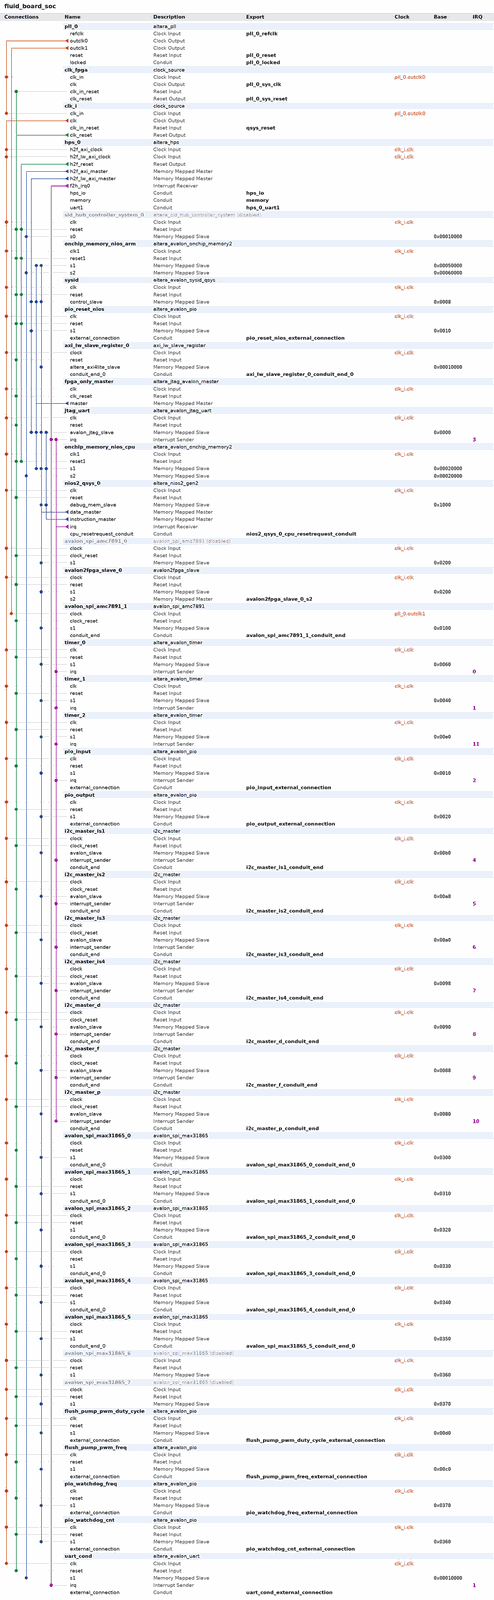
[diagram p0: system contents, whole]
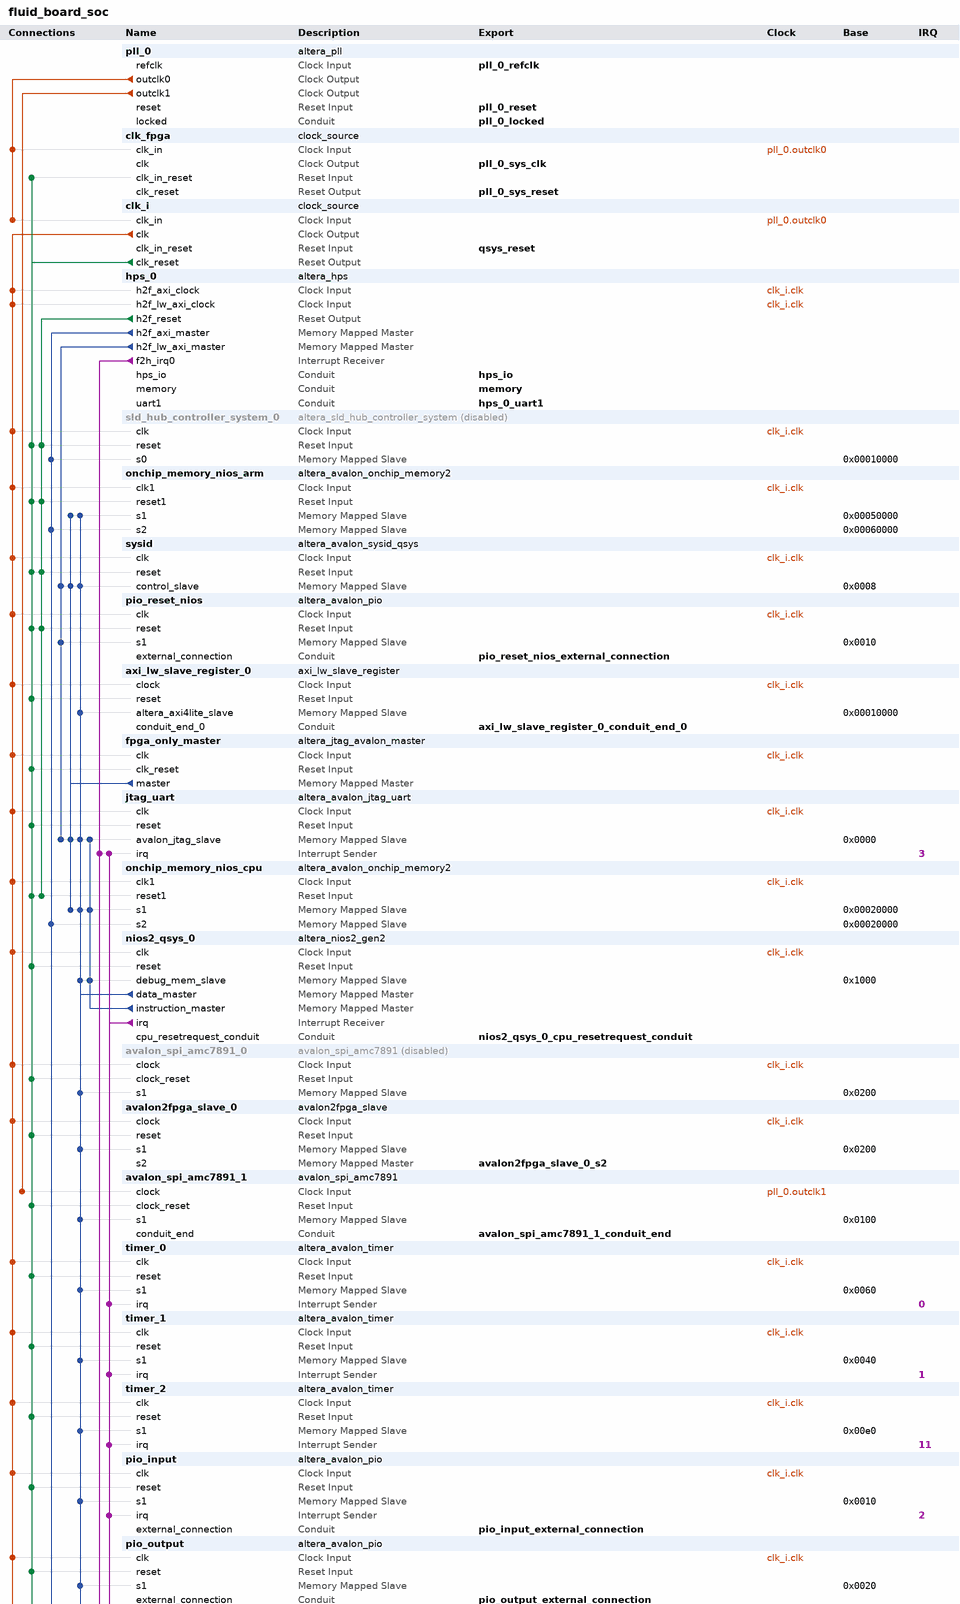
[diagram p1: system contents, upper part]
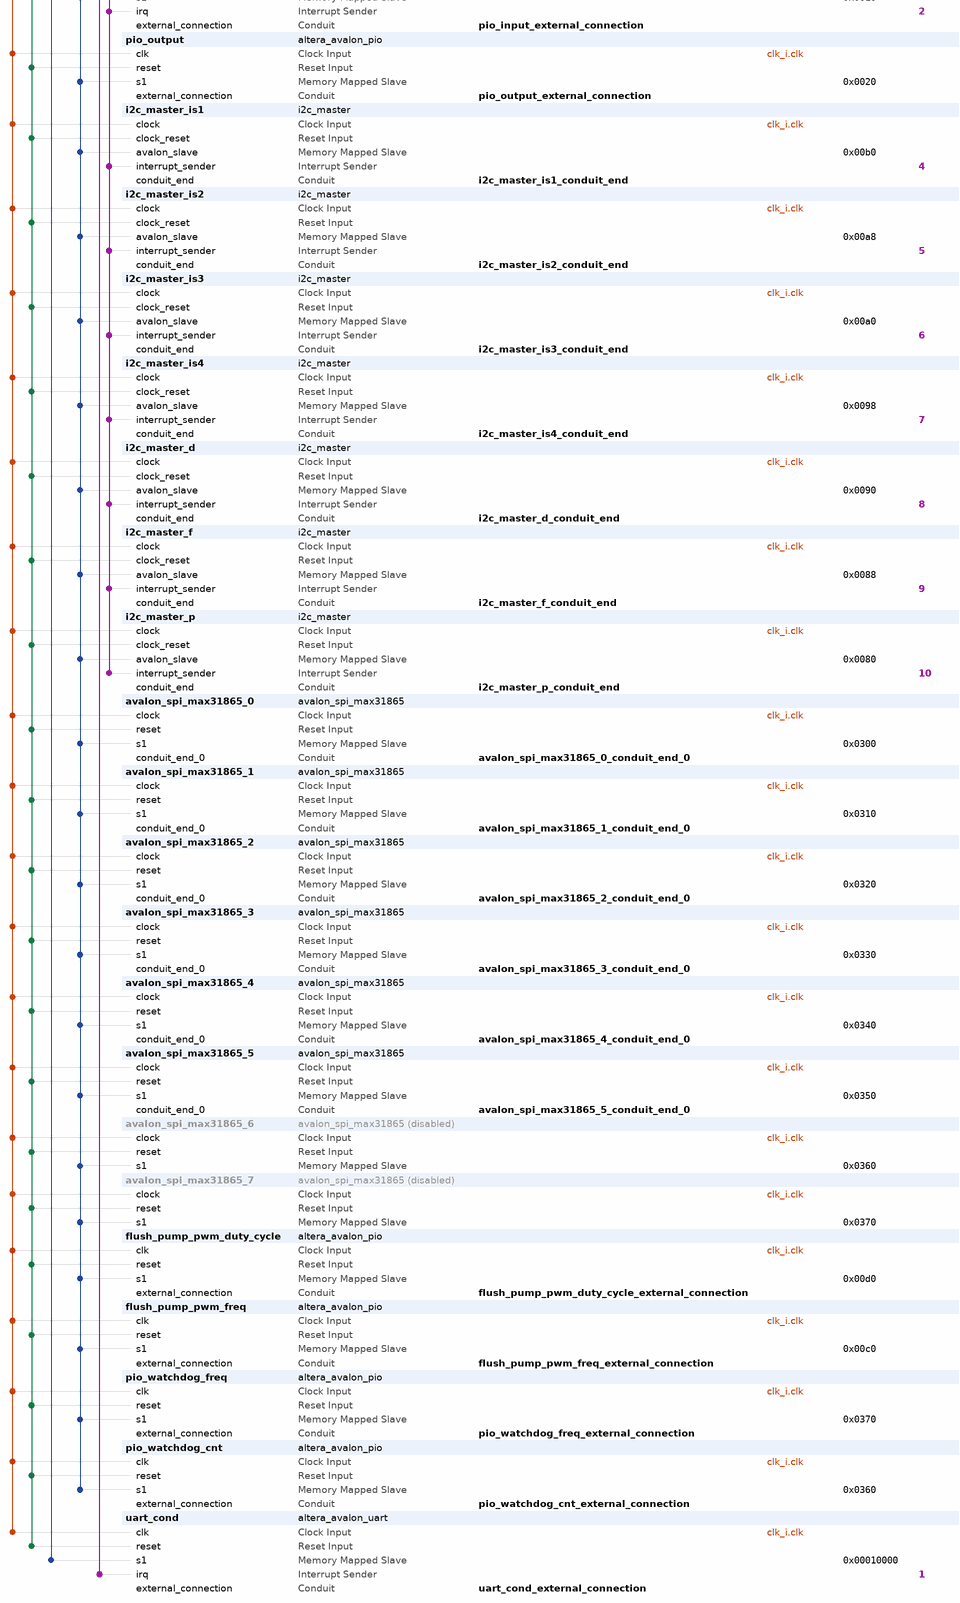
[diagram p2: system contents, lower part]
# Platform Designer (Qsys) system fluid_board_soc, Cyclone V 5CSEBA2U23C8
# Parameters at their usual value, and those the tool derives, are not listed.
package require -exact qsys 17.1
create_system fluid_board_soc
set_project_property DEVICE_FAMILY {Cyclone V}
set_project_property DEVICE 5CSEBA2U23C8

add_instance pll_0 altera_pll 17.1
set_instance_parameter_value pll_0 gui_device_speed_grade 2
set_instance_parameter_value pll_0 gui_number_of_clocks 2
set_instance_parameter_value pll_0 gui_operation_mode direct
set_instance_parameter_value pll_0 gui_output_clock_frequency0 50.0
set_instance_parameter_value pll_0 gui_output_clock_frequency1 12.5
set_instance_parameter_value pll_0 gui_pll_mode {Integer-N PLL}
set_instance_parameter_value pll_0 gui_reference_clock_frequency 50.0
set_instance_parameter_value pll_0 gui_use_locked true

add_instance clk_fpga clock_source 17.1
set_instance_parameter_value clk_fpga clockFrequency 50000000

add_instance clk_i clock_source 17.1
set_instance_parameter_value clk_i clockFrequency 50000000

add_instance hps_0 altera_hps 17.1
set_instance_parameter_value hps_0 EMAC0_Mode RGMII
set_instance_parameter_value hps_0 EMAC0_PinMuxing {HPS I/O Set 0}
set_instance_parameter_value hps_0 EMAC1_Mode N/A
set_instance_parameter_value hps_0 EMAC1_PinMuxing Unused
set_instance_parameter_value hps_0 F2SCLK_COLDRST_Enable false
set_instance_parameter_value hps_0 F2SCLK_DBGRST_Enable false
set_instance_parameter_value hps_0 F2SCLK_WARMRST_Enable false
set_instance_parameter_value hps_0 F2SINTERRUPT_Enable true
set_instance_parameter_value hps_0 F2S_Width 0
set_instance_parameter_value hps_0 FPGA_PERIPHERAL_OUTPUT_CLOCK_FREQ_EMAC0_GTX_CLK 100
set_instance_parameter_value hps_0 FPGA_PERIPHERAL_OUTPUT_CLOCK_FREQ_EMAC0_MD_CLK 100.0
set_instance_parameter_value hps_0 FPGA_PERIPHERAL_OUTPUT_CLOCK_FREQ_EMAC1_GTX_CLK 100
set_instance_parameter_value hps_0 FPGA_PERIPHERAL_OUTPUT_CLOCK_FREQ_EMAC1_MD_CLK 100.0
set_instance_parameter_value hps_0 HPS_PROTOCOL DDR3
set_instance_parameter_value hps_0 I2C0_Mode N/A
set_instance_parameter_value hps_0 I2C0_PinMuxing Unused
set_instance_parameter_value hps_0 I2C1_Mode N/A
set_instance_parameter_value hps_0 I2C1_PinMuxing Unused
set_instance_parameter_value hps_0 LWH2F_Enable true
set_instance_parameter_value hps_0 MEM_BANKADDR_WIDTH 3
set_instance_parameter_value hps_0 MEM_CLK_FREQ 333.3
set_instance_parameter_value hps_0 MEM_COL_ADDR_WIDTH 10
set_instance_parameter_value hps_0 MEM_DQ_WIDTH 32
set_instance_parameter_value hps_0 MEM_DRV_STR RZQ/6
set_instance_parameter_value hps_0 MEM_ROW_ADDR_WIDTH 15
set_instance_parameter_value hps_0 MEM_RTT_NOM RZQ/6
set_instance_parameter_value hps_0 MEM_RTT_WR {Dynamic ODT off}
set_instance_parameter_value hps_0 MEM_TCL 6
set_instance_parameter_value hps_0 MEM_TFAW_NS 40.0
set_instance_parameter_value hps_0 MEM_TINIT_US 512
set_instance_parameter_value hps_0 MEM_TRAS_NS 35.0
set_instance_parameter_value hps_0 MEM_TRCD_NS 13.75
set_instance_parameter_value hps_0 MEM_TREFI_US 3.9
set_instance_parameter_value hps_0 MEM_TRFC_NS 350.0
set_instance_parameter_value hps_0 MEM_TRP_NS 13.75
set_instance_parameter_value hps_0 MEM_TRRD_NS 12.0
set_instance_parameter_value hps_0 MEM_TRTP_NS 12.0
set_instance_parameter_value hps_0 MEM_VENDOR JEDEC
set_instance_parameter_value hps_0 MEM_VOLTAGE {1.35V DDR3L}
set_instance_parameter_value hps_0 MEM_WTCL 6
set_instance_parameter_value hps_0 QSPI_Mode N/A
set_instance_parameter_value hps_0 QSPI_PinMuxing Unused
set_instance_parameter_value hps_0 REF_CLK_FREQ 25.0
set_instance_parameter_value hps_0 S2FCLK_USER2CLK 4
set_instance_parameter_value hps_0 S2F_Width 2
set_instance_parameter_value hps_0 SDIO_Mode {8-bit Data}
set_instance_parameter_value hps_0 SDIO_PinMuxing {HPS I/O Set 0}
set_instance_parameter_value hps_0 SPIM1_Mode N/A
set_instance_parameter_value hps_0 SPIM1_PinMuxing Unused
set_instance_parameter_value hps_0 STM_Enable false
set_instance_parameter_value hps_0 TIMING_BOARD_AC_SKEW 0.02
set_instance_parameter_value hps_0 TIMING_BOARD_AC_TO_CK_SKEW 0.0
set_instance_parameter_value hps_0 TIMING_BOARD_DQ_TO_DQS_SKEW 0.0
set_instance_parameter_value hps_0 TIMING_BOARD_MAX_CK_DELAY 0.6
set_instance_parameter_value hps_0 TIMING_BOARD_MAX_DQS_DELAY 0.6
set_instance_parameter_value hps_0 TIMING_BOARD_SKEW_BETWEEN_DQS 0.02
set_instance_parameter_value hps_0 TIMING_BOARD_SKEW_CKDQS_DIMM_MAX 0.01
set_instance_parameter_value hps_0 TIMING_BOARD_SKEW_CKDQS_DIMM_MIN -0.01
set_instance_parameter_value hps_0 TIMING_BOARD_SKEW_WITHIN_DQS 0.02
set_instance_parameter_value hps_0 TIMING_TDH 45
set_instance_parameter_value hps_0 TIMING_TDQSCK 225
set_instance_parameter_value hps_0 TIMING_TDQSQ 100
set_instance_parameter_value hps_0 TIMING_TDQSS 0.27
set_instance_parameter_value hps_0 TIMING_TDS 10
set_instance_parameter_value hps_0 TIMING_TDSH 0.18
set_instance_parameter_value hps_0 TIMING_TDSS 0.18
set_instance_parameter_value hps_0 TIMING_TIH 120
set_instance_parameter_value hps_0 TIMING_TIS 45
set_instance_parameter_value hps_0 TIMING_TQSH 0.4
set_instance_parameter_value hps_0 UART0_Mode {No Flow Control}
set_instance_parameter_value hps_0 UART0_PinMuxing {HPS I/O Set 0}
set_instance_parameter_value hps_0 UART1_Mode Full
set_instance_parameter_value hps_0 UART1_PinMuxing FPGA
set_instance_parameter_value hps_0 USB1_Mode SDR
set_instance_parameter_value hps_0 USB1_PinMuxing {HPS I/O Set 1}
set_instance_parameter_value hps_0 desired_cfg_clk_mhz 100.0
set_instance_parameter_value hps_0 desired_qspi_clk_mhz 400.0

add_instance sld_hub_controller_system_0 altera_sld_hub_controller_system 17.1
set_instance_property sld_hub_controller_system_0 ENABLED false
set_instance_parameter_value sld_hub_controller_system_0 ENABLE_JTAG_IO_SELECTION 0

add_instance onchip_memory_nios_arm altera_avalon_onchip_memory2 17.1
set_instance_parameter_value onchip_memory_nios_arm dataWidth 16
set_instance_parameter_value onchip_memory_nios_arm dualPort true
set_instance_parameter_value onchip_memory_nios_arm initMemContent true
set_instance_parameter_value onchip_memory_nios_arm initializationFileName onchip_mem.hex
set_instance_parameter_value onchip_memory_nios_arm memorySize 32768
set_instance_parameter_value onchip_memory_nios_arm singleClockOperation true

add_instance sysid altera_avalon_sysid_qsys 17.1
set_instance_parameter_value sysid id 7

add_instance pio_reset_nios altera_avalon_pio 17.1
set_instance_parameter_value pio_reset_nios direction Output
set_instance_parameter_value pio_reset_nios width 1

add_instance axi_lw_slave_register_0 axi_lw_slave_register 15.1
set_instance_parameter_value axi_lw_slave_register_0 g_master_addr_width 16
set_instance_parameter_value axi_lw_slave_register_0 g_master_data_width 32
set_instance_parameter_value axi_lw_slave_register_0 g_master_id_width 12

add_instance fpga_only_master altera_jtag_avalon_master 17.1

add_instance jtag_uart altera_avalon_jtag_uart 17.1
set_instance_parameter_value jtag_uart allowMultipleConnections true
set_instance_parameter_value jtag_uart simInteractiveOptions NO_INTERACTIVE_WINDOWS

add_instance onchip_memory_nios_cpu altera_avalon_onchip_memory2 17.1
set_instance_parameter_value onchip_memory_nios_cpu dataWidth 32
set_instance_parameter_value onchip_memory_nios_cpu dualPort true
set_instance_parameter_value onchip_memory_nios_cpu initMemContent true
set_instance_parameter_value onchip_memory_nios_cpu initializationFileName onchip_mem.hex
set_instance_parameter_value onchip_memory_nios_cpu memorySize 98304
set_instance_parameter_value onchip_memory_nios_cpu singleClockOperation true

add_instance nios2_qsys_0 altera_nios2_gen2 17.1
set_instance_parameter_value nios2_qsys_0 cpuReset true
set_instance_parameter_value nios2_qsys_0 dcache_size 0
set_instance_parameter_value nios2_qsys_0 exceptionSlave onchip_memory_nios_cpu.s1
set_instance_parameter_value nios2_qsys_0 icache_size 512
set_instance_parameter_value nios2_qsys_0 impl Fast
set_instance_parameter_value nios2_qsys_0 resetSlave onchip_memory_nios_cpu.s1
set_instance_parameter_value nios2_qsys_0 setting_activateTrace true

add_instance avalon_spi_amc7891_0 avalon_spi_amc7891 14.0
set_instance_property avalon_spi_amc7891_0 ENABLED false

add_instance avalon2fpga_slave_0 avalon2fpga_slave 5.1
set_instance_parameter_value avalon2fpga_slave_0 g_address_width 7
set_instance_parameter_value avalon2fpga_slave_0 g_data_width 16

add_instance avalon_spi_amc7891_1 avalon_spi_amc7891 14.0

add_instance timer_0 altera_avalon_timer 17.1
set_instance_parameter_value timer_0 period 1
set_instance_parameter_value timer_0 periodUnits MSEC

add_instance timer_1 altera_avalon_timer 17.1
set_instance_parameter_value timer_1 period 1
set_instance_parameter_value timer_1 periodUnits MSEC

add_instance timer_2 altera_avalon_timer 17.1
set_instance_parameter_value timer_2 period 1
set_instance_parameter_value timer_2 periodUnits MSEC

add_instance pio_input altera_avalon_pio 17.1
set_instance_parameter_value pio_input direction Input
set_instance_parameter_value pio_input generateIRQ true
set_instance_parameter_value pio_input width 15

add_instance pio_output altera_avalon_pio 17.1
set_instance_parameter_value pio_output bitModifyingOutReg true
set_instance_parameter_value pio_output direction Output
set_instance_parameter_value pio_output width 16

add_instance i2c_master_is1 i2c_master 14.1

add_instance i2c_master_is2 i2c_master 14.1

add_instance i2c_master_is3 i2c_master 14.1

add_instance i2c_master_is4 i2c_master 14.1

add_instance i2c_master_d i2c_master 14.1

add_instance i2c_master_f i2c_master 14.1

add_instance i2c_master_p i2c_master 14.1

add_instance avalon_spi_max31865_0 avalon_spi_max31865 1.0
set_instance_parameter_value avalon_spi_max31865_0 g_cpol {'0'}

add_instance avalon_spi_max31865_1 avalon_spi_max31865 1.0
set_instance_parameter_value avalon_spi_max31865_1 g_cpol {'0'}

add_instance avalon_spi_max31865_2 avalon_spi_max31865 1.0
set_instance_parameter_value avalon_spi_max31865_2 g_cpol {'0'}

add_instance avalon_spi_max31865_3 avalon_spi_max31865 1.0
set_instance_parameter_value avalon_spi_max31865_3 g_cpol {'0'}

add_instance avalon_spi_max31865_4 avalon_spi_max31865 1.0
set_instance_parameter_value avalon_spi_max31865_4 g_cpol {'0'}

add_instance avalon_spi_max31865_5 avalon_spi_max31865 1.0
set_instance_parameter_value avalon_spi_max31865_5 g_cpol {'0'}

add_instance avalon_spi_max31865_6 avalon_spi_max31865 1.0
set_instance_property avalon_spi_max31865_6 ENABLED false
set_instance_parameter_value avalon_spi_max31865_6 g_cpol {'0'}

add_instance avalon_spi_max31865_7 avalon_spi_max31865 1.0
set_instance_property avalon_spi_max31865_7 ENABLED false
set_instance_parameter_value avalon_spi_max31865_7 g_cpol {'0'}

add_instance flush_pump_pwm_duty_cycle altera_avalon_pio 17.1
set_instance_parameter_value flush_pump_pwm_duty_cycle direction Output
set_instance_parameter_value flush_pump_pwm_duty_cycle width 32

add_instance flush_pump_pwm_freq altera_avalon_pio 17.1
set_instance_parameter_value flush_pump_pwm_freq direction Output
set_instance_parameter_value flush_pump_pwm_freq width 32

add_instance pio_watchdog_freq altera_avalon_pio 17.1
set_instance_parameter_value pio_watchdog_freq direction Output
set_instance_parameter_value pio_watchdog_freq width 32

add_instance pio_watchdog_cnt altera_avalon_pio 17.1
set_instance_parameter_value pio_watchdog_cnt direction Output
set_instance_parameter_value pio_watchdog_cnt width 32

add_instance uart_cond altera_avalon_uart 17.1
set_instance_parameter_value uart_cond baud 115200
set_instance_parameter_value uart_cond dataBits 8
set_instance_parameter_value uart_cond fixedBaud false
set_instance_parameter_value uart_cond parity NONE
set_instance_parameter_value uart_cond stopBits 1

# connections
add_connection clk_i.clk avalon2fpga_slave_0.clock clock
add_connection clk_i.clk avalon_spi_amc7891_0.clock clock
add_connection clk_i.clk avalon_spi_max31865_0.clock clock
add_connection clk_i.clk avalon_spi_max31865_1.clock clock
add_connection clk_i.clk avalon_spi_max31865_2.clock clock
add_connection clk_i.clk avalon_spi_max31865_3.clock clock
add_connection clk_i.clk avalon_spi_max31865_4.clock clock
add_connection clk_i.clk avalon_spi_max31865_5.clock clock
add_connection clk_i.clk avalon_spi_max31865_6.clock clock
add_connection clk_i.clk avalon_spi_max31865_7.clock clock
add_connection clk_i.clk axi_lw_slave_register_0.clock clock
add_connection clk_i.clk flush_pump_pwm_duty_cycle.clk clock
add_connection clk_i.clk flush_pump_pwm_freq.clk clock
add_connection clk_i.clk fpga_only_master.clk clock
add_connection clk_i.clk hps_0.h2f_axi_clock clock
add_connection clk_i.clk hps_0.h2f_lw_axi_clock clock
add_connection clk_i.clk i2c_master_d.clock clock
add_connection clk_i.clk i2c_master_f.clock clock
add_connection clk_i.clk i2c_master_is1.clock clock
add_connection clk_i.clk i2c_master_is2.clock clock
add_connection clk_i.clk i2c_master_is3.clock clock
add_connection clk_i.clk i2c_master_is4.clock clock
add_connection clk_i.clk i2c_master_p.clock clock
add_connection clk_i.clk jtag_uart.clk clock
add_connection clk_i.clk nios2_qsys_0.clk clock
add_connection clk_i.clk onchip_memory_nios_arm.clk1 clock
add_connection clk_i.clk onchip_memory_nios_cpu.clk1 clock
add_connection clk_i.clk pio_input.clk clock
add_connection clk_i.clk pio_output.clk clock
add_connection clk_i.clk pio_reset_nios.clk clock
add_connection clk_i.clk pio_watchdog_cnt.clk clock
add_connection clk_i.clk pio_watchdog_freq.clk clock
add_connection clk_i.clk sld_hub_controller_system_0.clk clock
add_connection clk_i.clk sysid.clk clock
add_connection clk_i.clk timer_0.clk clock
add_connection clk_i.clk timer_1.clk clock
add_connection clk_i.clk timer_2.clk clock
add_connection clk_i.clk uart_cond.clk clock
add_connection pll_0.outclk0 clk_fpga.clk_in clock
add_connection pll_0.outclk0 clk_i.clk_in clock
add_connection pll_0.outclk1 avalon_spi_amc7891_1.clock clock
add_connection clk_i.clk_reset avalon2fpga_slave_0.reset reset
add_connection clk_i.clk_reset avalon_spi_amc7891_0.clock_reset reset
add_connection clk_i.clk_reset avalon_spi_amc7891_1.clock_reset reset
add_connection clk_i.clk_reset avalon_spi_max31865_0.reset reset
add_connection clk_i.clk_reset avalon_spi_max31865_1.reset reset
add_connection clk_i.clk_reset avalon_spi_max31865_2.reset reset
add_connection clk_i.clk_reset avalon_spi_max31865_3.reset reset
add_connection clk_i.clk_reset avalon_spi_max31865_4.reset reset
add_connection clk_i.clk_reset avalon_spi_max31865_5.reset reset
add_connection clk_i.clk_reset avalon_spi_max31865_6.reset reset
add_connection clk_i.clk_reset avalon_spi_max31865_7.reset reset
add_connection clk_i.clk_reset axi_lw_slave_register_0.reset reset
add_connection clk_i.clk_reset clk_fpga.clk_in_reset reset
add_connection clk_i.clk_reset flush_pump_pwm_duty_cycle.reset reset
add_connection clk_i.clk_reset flush_pump_pwm_freq.reset reset
add_connection clk_i.clk_reset fpga_only_master.clk_reset reset
add_connection clk_i.clk_reset i2c_master_d.clock_reset reset
add_connection clk_i.clk_reset i2c_master_f.clock_reset reset
add_connection clk_i.clk_reset i2c_master_is1.clock_reset reset
add_connection clk_i.clk_reset i2c_master_is2.clock_reset reset
add_connection clk_i.clk_reset i2c_master_is3.clock_reset reset
add_connection clk_i.clk_reset i2c_master_is4.clock_reset reset
add_connection clk_i.clk_reset i2c_master_p.clock_reset reset
add_connection clk_i.clk_reset jtag_uart.reset reset
add_connection clk_i.clk_reset nios2_qsys_0.reset reset
add_connection clk_i.clk_reset onchip_memory_nios_arm.reset1 reset
add_connection clk_i.clk_reset onchip_memory_nios_cpu.reset1 reset
add_connection clk_i.clk_reset pio_input.reset reset
add_connection clk_i.clk_reset pio_output.reset reset
add_connection clk_i.clk_reset pio_reset_nios.reset reset
add_connection clk_i.clk_reset pio_watchdog_cnt.reset reset
add_connection clk_i.clk_reset pio_watchdog_freq.reset reset
add_connection clk_i.clk_reset sld_hub_controller_system_0.reset reset
add_connection clk_i.clk_reset sysid.reset reset
add_connection clk_i.clk_reset timer_0.reset reset
add_connection clk_i.clk_reset timer_1.reset reset
add_connection clk_i.clk_reset timer_2.reset reset
add_connection clk_i.clk_reset uart_cond.reset reset
add_connection hps_0.h2f_reset onchip_memory_nios_arm.reset1 reset
add_connection hps_0.h2f_reset onchip_memory_nios_cpu.reset1 reset
add_connection hps_0.h2f_reset pio_reset_nios.reset reset
add_connection hps_0.h2f_reset sld_hub_controller_system_0.reset reset
add_connection hps_0.h2f_reset sysid.reset reset
add_connection fpga_only_master.master jtag_uart.avalon_jtag_slave avalon
set_connection_parameter_value fpga_only_master.master/jtag_uart.avalon_jtag_slave baseAddress 0x0000
add_connection fpga_only_master.master onchip_memory_nios_arm.s1 avalon
set_connection_parameter_value fpga_only_master.master/onchip_memory_nios_arm.s1 baseAddress 0x00050000
add_connection fpga_only_master.master onchip_memory_nios_cpu.s1 avalon
set_connection_parameter_value fpga_only_master.master/onchip_memory_nios_cpu.s1 baseAddress 0x00020000
add_connection fpga_only_master.master sysid.control_slave avalon
set_connection_parameter_value fpga_only_master.master/sysid.control_slave baseAddress 0x0008
add_connection hps_0.h2f_axi_master onchip_memory_nios_arm.s2 avalon
set_connection_parameter_value hps_0.h2f_axi_master/onchip_memory_nios_arm.s2 baseAddress 0x00060000
add_connection hps_0.h2f_axi_master onchip_memory_nios_cpu.s2 avalon
set_connection_parameter_value hps_0.h2f_axi_master/onchip_memory_nios_cpu.s2 baseAddress 0x00020000
add_connection hps_0.h2f_axi_master sld_hub_controller_system_0.s0 avalon
set_connection_parameter_value hps_0.h2f_axi_master/sld_hub_controller_system_0.s0 baseAddress 0x00010000
add_connection hps_0.h2f_axi_master uart_cond.s1 avalon
set_connection_parameter_value hps_0.h2f_axi_master/uart_cond.s1 baseAddress 0x00010000
add_connection hps_0.h2f_lw_axi_master jtag_uart.avalon_jtag_slave avalon
set_connection_parameter_value hps_0.h2f_lw_axi_master/jtag_uart.avalon_jtag_slave baseAddress 0x0000
add_connection hps_0.h2f_lw_axi_master pio_reset_nios.s1 avalon
set_connection_parameter_value hps_0.h2f_lw_axi_master/pio_reset_nios.s1 baseAddress 0x0010
add_connection hps_0.h2f_lw_axi_master sysid.control_slave avalon
set_connection_parameter_value hps_0.h2f_lw_axi_master/sysid.control_slave baseAddress 0x0008
add_connection nios2_qsys_0.data_master avalon2fpga_slave_0.s1 avalon
set_connection_parameter_value nios2_qsys_0.data_master/avalon2fpga_slave_0.s1 baseAddress 0x0200
add_connection nios2_qsys_0.data_master avalon_spi_amc7891_0.s1 avalon
set_connection_parameter_value nios2_qsys_0.data_master/avalon_spi_amc7891_0.s1 baseAddress 0x0200
add_connection nios2_qsys_0.data_master avalon_spi_amc7891_1.s1 avalon
set_connection_parameter_value nios2_qsys_0.data_master/avalon_spi_amc7891_1.s1 baseAddress 0x0100
add_connection nios2_qsys_0.data_master avalon_spi_max31865_0.s1 avalon
set_connection_parameter_value nios2_qsys_0.data_master/avalon_spi_max31865_0.s1 baseAddress 0x0300
add_connection nios2_qsys_0.data_master avalon_spi_max31865_1.s1 avalon
set_connection_parameter_value nios2_qsys_0.data_master/avalon_spi_max31865_1.s1 baseAddress 0x0310
add_connection nios2_qsys_0.data_master avalon_spi_max31865_2.s1 avalon
set_connection_parameter_value nios2_qsys_0.data_master/avalon_spi_max31865_2.s1 baseAddress 0x0320
add_connection nios2_qsys_0.data_master avalon_spi_max31865_3.s1 avalon
set_connection_parameter_value nios2_qsys_0.data_master/avalon_spi_max31865_3.s1 baseAddress 0x0330
add_connection nios2_qsys_0.data_master avalon_spi_max31865_4.s1 avalon
set_connection_parameter_value nios2_qsys_0.data_master/avalon_spi_max31865_4.s1 baseAddress 0x0340
add_connection nios2_qsys_0.data_master avalon_spi_max31865_5.s1 avalon
set_connection_parameter_value nios2_qsys_0.data_master/avalon_spi_max31865_5.s1 baseAddress 0x0350
add_connection nios2_qsys_0.data_master avalon_spi_max31865_6.s1 avalon
set_connection_parameter_value nios2_qsys_0.data_master/avalon_spi_max31865_6.s1 baseAddress 0x0360
add_connection nios2_qsys_0.data_master avalon_spi_max31865_7.s1 avalon
set_connection_parameter_value nios2_qsys_0.data_master/avalon_spi_max31865_7.s1 baseAddress 0x0370
add_connection nios2_qsys_0.data_master axi_lw_slave_register_0.altera_axi4lite_slave avalon
set_connection_parameter_value nios2_qsys_0.data_master/axi_lw_slave_register_0.altera_axi4lite_slave baseAddress 0x00010000
add_connection nios2_qsys_0.data_master flush_pump_pwm_duty_cycle.s1 avalon
set_connection_parameter_value nios2_qsys_0.data_master/flush_pump_pwm_duty_cycle.s1 baseAddress 0x00d0
add_connection nios2_qsys_0.data_master flush_pump_pwm_freq.s1 avalon
set_connection_parameter_value nios2_qsys_0.data_master/flush_pump_pwm_freq.s1 baseAddress 0x00c0
add_connection nios2_qsys_0.data_master i2c_master_d.avalon_slave avalon
set_connection_parameter_value nios2_qsys_0.data_master/i2c_master_d.avalon_slave baseAddress 0x0090
add_connection nios2_qsys_0.data_master i2c_master_f.avalon_slave avalon
set_connection_parameter_value nios2_qsys_0.data_master/i2c_master_f.avalon_slave baseAddress 0x0088
add_connection nios2_qsys_0.data_master i2c_master_is1.avalon_slave avalon
set_connection_parameter_value nios2_qsys_0.data_master/i2c_master_is1.avalon_slave baseAddress 0x00b0
add_connection nios2_qsys_0.data_master i2c_master_is2.avalon_slave avalon
set_connection_parameter_value nios2_qsys_0.data_master/i2c_master_is2.avalon_slave baseAddress 0x00a8
add_connection nios2_qsys_0.data_master i2c_master_is3.avalon_slave avalon
set_connection_parameter_value nios2_qsys_0.data_master/i2c_master_is3.avalon_slave baseAddress 0x00a0
add_connection nios2_qsys_0.data_master i2c_master_is4.avalon_slave avalon
set_connection_parameter_value nios2_qsys_0.data_master/i2c_master_is4.avalon_slave baseAddress 0x0098
add_connection nios2_qsys_0.data_master i2c_master_p.avalon_slave avalon
set_connection_parameter_value nios2_qsys_0.data_master/i2c_master_p.avalon_slave baseAddress 0x0080
add_connection nios2_qsys_0.data_master jtag_uart.avalon_jtag_slave avalon
set_connection_parameter_value nios2_qsys_0.data_master/jtag_uart.avalon_jtag_slave baseAddress 0x0000
add_connection nios2_qsys_0.data_master nios2_qsys_0.debug_mem_slave avalon
set_connection_parameter_value nios2_qsys_0.data_master/nios2_qsys_0.debug_mem_slave baseAddress 0x1000
add_connection nios2_qsys_0.data_master onchip_memory_nios_arm.s1 avalon
set_connection_parameter_value nios2_qsys_0.data_master/onchip_memory_nios_arm.s1 baseAddress 0x00050000
add_connection nios2_qsys_0.data_master onchip_memory_nios_cpu.s1 avalon
set_connection_parameter_value nios2_qsys_0.data_master/onchip_memory_nios_cpu.s1 baseAddress 0x00020000
add_connection nios2_qsys_0.data_master pio_input.s1 avalon
set_connection_parameter_value nios2_qsys_0.data_master/pio_input.s1 baseAddress 0x0010
add_connection nios2_qsys_0.data_master pio_output.s1 avalon
set_connection_parameter_value nios2_qsys_0.data_master/pio_output.s1 baseAddress 0x0020
add_connection nios2_qsys_0.data_master pio_watchdog_cnt.s1 avalon
set_connection_parameter_value nios2_qsys_0.data_master/pio_watchdog_cnt.s1 baseAddress 0x0360
add_connection nios2_qsys_0.data_master pio_watchdog_freq.s1 avalon
set_connection_parameter_value nios2_qsys_0.data_master/pio_watchdog_freq.s1 baseAddress 0x0370
add_connection nios2_qsys_0.data_master sysid.control_slave avalon
set_connection_parameter_value nios2_qsys_0.data_master/sysid.control_slave baseAddress 0x0008
add_connection nios2_qsys_0.data_master timer_0.s1 avalon
set_connection_parameter_value nios2_qsys_0.data_master/timer_0.s1 baseAddress 0x0060
add_connection nios2_qsys_0.data_master timer_1.s1 avalon
set_connection_parameter_value nios2_qsys_0.data_master/timer_1.s1 baseAddress 0x0040
add_connection nios2_qsys_0.data_master timer_2.s1 avalon
set_connection_parameter_value nios2_qsys_0.data_master/timer_2.s1 baseAddress 0x00e0
add_connection nios2_qsys_0.instruction_master jtag_uart.avalon_jtag_slave avalon
set_connection_parameter_value nios2_qsys_0.instruction_master/jtag_uart.avalon_jtag_slave baseAddress 0x0000
add_connection nios2_qsys_0.instruction_master nios2_qsys_0.debug_mem_slave avalon
set_connection_parameter_value nios2_qsys_0.instruction_master/nios2_qsys_0.debug_mem_slave baseAddress 0x1000
add_connection nios2_qsys_0.instruction_master onchip_memory_nios_cpu.s1 avalon
set_connection_parameter_value nios2_qsys_0.instruction_master/onchip_memory_nios_cpu.s1 baseAddress 0x00020000
add_connection hps_0.f2h_irq0 jtag_uart.irq interrupt
set_connection_parameter_value hps_0.f2h_irq0/jtag_uart.irq irqNumber 0
add_connection hps_0.f2h_irq0 uart_cond.irq interrupt
set_connection_parameter_value hps_0.f2h_irq0/uart_cond.irq irqNumber 1
add_connection nios2_qsys_0.irq i2c_master_d.interrupt_sender interrupt
set_connection_parameter_value nios2_qsys_0.irq/i2c_master_d.interrupt_sender irqNumber 8
add_connection nios2_qsys_0.irq i2c_master_f.interrupt_sender interrupt
set_connection_parameter_value nios2_qsys_0.irq/i2c_master_f.interrupt_sender irqNumber 9
add_connection nios2_qsys_0.irq i2c_master_is1.interrupt_sender interrupt
set_connection_parameter_value nios2_qsys_0.irq/i2c_master_is1.interrupt_sender irqNumber 4
add_connection nios2_qsys_0.irq i2c_master_is2.interrupt_sender interrupt
set_connection_parameter_value nios2_qsys_0.irq/i2c_master_is2.interrupt_sender irqNumber 5
add_connection nios2_qsys_0.irq i2c_master_is3.interrupt_sender interrupt
set_connection_parameter_value nios2_qsys_0.irq/i2c_master_is3.interrupt_sender irqNumber 6
add_connection nios2_qsys_0.irq i2c_master_is4.interrupt_sender interrupt
set_connection_parameter_value nios2_qsys_0.irq/i2c_master_is4.interrupt_sender irqNumber 7
add_connection nios2_qsys_0.irq i2c_master_p.interrupt_sender interrupt
set_connection_parameter_value nios2_qsys_0.irq/i2c_master_p.interrupt_sender irqNumber 10
add_connection nios2_qsys_0.irq jtag_uart.irq interrupt
set_connection_parameter_value nios2_qsys_0.irq/jtag_uart.irq irqNumber 3
add_connection nios2_qsys_0.irq pio_input.irq interrupt
set_connection_parameter_value nios2_qsys_0.irq/pio_input.irq irqNumber 2
add_connection nios2_qsys_0.irq timer_0.irq interrupt
set_connection_parameter_value nios2_qsys_0.irq/timer_0.irq irqNumber 0
add_connection nios2_qsys_0.irq timer_1.irq interrupt
set_connection_parameter_value nios2_qsys_0.irq/timer_1.irq irqNumber 1
add_connection nios2_qsys_0.irq timer_2.irq interrupt
set_connection_parameter_value nios2_qsys_0.irq/timer_2.irq irqNumber 11

# exported interfaces
add_interface avalon2fpga_slave_0_s2 avalon master
set_interface_property avalon2fpga_slave_0_s2 EXPORT_OF avalon2fpga_slave_0.s2
add_interface avalon_spi_amc7891_1_conduit_end conduit end
set_interface_property avalon_spi_amc7891_1_conduit_end EXPORT_OF avalon_spi_amc7891_1.conduit_end
add_interface avalon_spi_max31865_0_conduit_end_0 conduit end
set_interface_property avalon_spi_max31865_0_conduit_end_0 EXPORT_OF avalon_spi_max31865_0.conduit_end_0
add_interface avalon_spi_max31865_1_conduit_end_0 conduit end
set_interface_property avalon_spi_max31865_1_conduit_end_0 EXPORT_OF avalon_spi_max31865_1.conduit_end_0
add_interface avalon_spi_max31865_2_conduit_end_0 conduit end
set_interface_property avalon_spi_max31865_2_conduit_end_0 EXPORT_OF avalon_spi_max31865_2.conduit_end_0
add_interface avalon_spi_max31865_3_conduit_end_0 conduit end
set_interface_property avalon_spi_max31865_3_conduit_end_0 EXPORT_OF avalon_spi_max31865_3.conduit_end_0
add_interface avalon_spi_max31865_4_conduit_end_0 conduit end
set_interface_property avalon_spi_max31865_4_conduit_end_0 EXPORT_OF avalon_spi_max31865_4.conduit_end_0
add_interface avalon_spi_max31865_5_conduit_end_0 conduit end
set_interface_property avalon_spi_max31865_5_conduit_end_0 EXPORT_OF avalon_spi_max31865_5.conduit_end_0
add_interface axi_lw_slave_register_0_conduit_end_0 conduit end
set_interface_property axi_lw_slave_register_0_conduit_end_0 EXPORT_OF axi_lw_slave_register_0.conduit_end_0
add_interface flush_pump_pwm_duty_cycle_external_connection conduit end
set_interface_property flush_pump_pwm_duty_cycle_external_connection EXPORT_OF flush_pump_pwm_duty_cycle.external_connection
add_interface flush_pump_pwm_freq_external_connection conduit end
set_interface_property flush_pump_pwm_freq_external_connection EXPORT_OF flush_pump_pwm_freq.external_connection
add_interface hps_0_uart1 conduit end
set_interface_property hps_0_uart1 EXPORT_OF hps_0.uart1
add_interface hps_io conduit end
set_interface_property hps_io EXPORT_OF hps_0.hps_io
add_interface i2c_master_d_conduit_end conduit end
set_interface_property i2c_master_d_conduit_end EXPORT_OF i2c_master_d.conduit_end
add_interface i2c_master_f_conduit_end conduit end
set_interface_property i2c_master_f_conduit_end EXPORT_OF i2c_master_f.conduit_end
add_interface i2c_master_is1_conduit_end conduit end
set_interface_property i2c_master_is1_conduit_end EXPORT_OF i2c_master_is1.conduit_end
add_interface i2c_master_is2_conduit_end conduit end
set_interface_property i2c_master_is2_conduit_end EXPORT_OF i2c_master_is2.conduit_end
add_interface i2c_master_is3_conduit_end conduit end
set_interface_property i2c_master_is3_conduit_end EXPORT_OF i2c_master_is3.conduit_end
add_interface i2c_master_is4_conduit_end conduit end
set_interface_property i2c_master_is4_conduit_end EXPORT_OF i2c_master_is4.conduit_end
add_interface i2c_master_p_conduit_end conduit end
set_interface_property i2c_master_p_conduit_end EXPORT_OF i2c_master_p.conduit_end
add_interface memory conduit end
set_interface_property memory EXPORT_OF hps_0.memory
add_interface nios2_qsys_0_cpu_resetrequest_conduit conduit end
set_interface_property nios2_qsys_0_cpu_resetrequest_conduit EXPORT_OF nios2_qsys_0.cpu_resetrequest_conduit
add_interface pio_input_external_connection conduit end
set_interface_property pio_input_external_connection EXPORT_OF pio_input.external_connection
add_interface pio_output_external_connection conduit end
set_interface_property pio_output_external_connection EXPORT_OF pio_output.external_connection
add_interface pio_reset_nios_external_connection conduit end
set_interface_property pio_reset_nios_external_connection EXPORT_OF pio_reset_nios.external_connection
add_interface pio_watchdog_cnt_external_connection conduit end
set_interface_property pio_watchdog_cnt_external_connection EXPORT_OF pio_watchdog_cnt.external_connection
add_interface pio_watchdog_freq_external_connection conduit end
set_interface_property pio_watchdog_freq_external_connection EXPORT_OF pio_watchdog_freq.external_connection
add_interface pll_0_locked conduit end
set_interface_property pll_0_locked EXPORT_OF pll_0.locked
add_interface pll_0_refclk clock sink
set_interface_property pll_0_refclk EXPORT_OF pll_0.refclk
add_interface pll_0_reset reset sink
set_interface_property pll_0_reset EXPORT_OF pll_0.reset
add_interface pll_0_sys_clk clock source
set_interface_property pll_0_sys_clk EXPORT_OF clk_fpga.clk
add_interface pll_0_sys_reset reset source
set_interface_property pll_0_sys_reset EXPORT_OF clk_fpga.clk_reset
add_interface qsys_reset reset sink
set_interface_property qsys_reset EXPORT_OF clk_i.clk_in_reset
add_interface uart_cond_external_connection conduit end
set_interface_property uart_cond_external_connection EXPORT_OF uart_cond.external_connection

set_interconnect_requirement {$system} qsys_mm.clockCrossingAdapter HANDSHAKE
set_interconnect_requirement {$system} qsys_mm.maxAdditionalLatency 1

save_system fluid_board_soc.qsys
